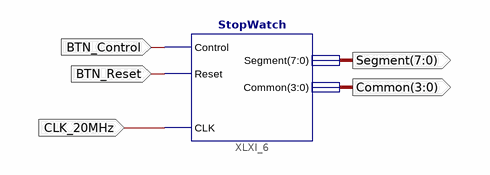
[diagram p0: schematic sheet 1]
// Xilinx ISE schematic main.sch (spartan6) as structural Verilog: 1 symbols, 5 ports
module main (
  input  BTN_Control,
  input  BTN_Reset,
  input  CLK_20MHz,
  output [7:0] Segment,
  output [3:0] Common
);

  StopWatch XLXI_6 (.Reset(BTN_Reset), .Control(BTN_Control), .Common(Common), .Segment(Segment), .CLK(CLK_20MHz));

  // Notes on the sheet:
  //   CLOCK_DEDICATED_ROUTE on signal BTN_Control = TRUE
  //   CLOCK_DEDICATED_ROUTE on signal BTN_Reset = TRUE
endmodule
